# Altium schematic sheet DIOT_Connectors_Magneto.SchDoc: DIOT
size 420 x 297 mm; Project: HVPSU_ISOL.PrjPCB; Author: G.Kasprowicz; CompanyName: WUT ISE; DrawnBy: G.Kasprowicz; Organization: WUT ISE; Address1: PW ISE; Address2: Nowowiejska 15/19 00-665 Warsaw; Address3: gkasprow@gmail.com; DocumentNumber: 2; Revision: 2; SheetNumber: 2; SheetTotal: 7; ModifiedBy: -; CheckedDate: -; Title2: Connector; DivGrp: WUT ISE; Designer: G.Kasprowicz; ModifiedDate: -; ProjectName: Sensor Box
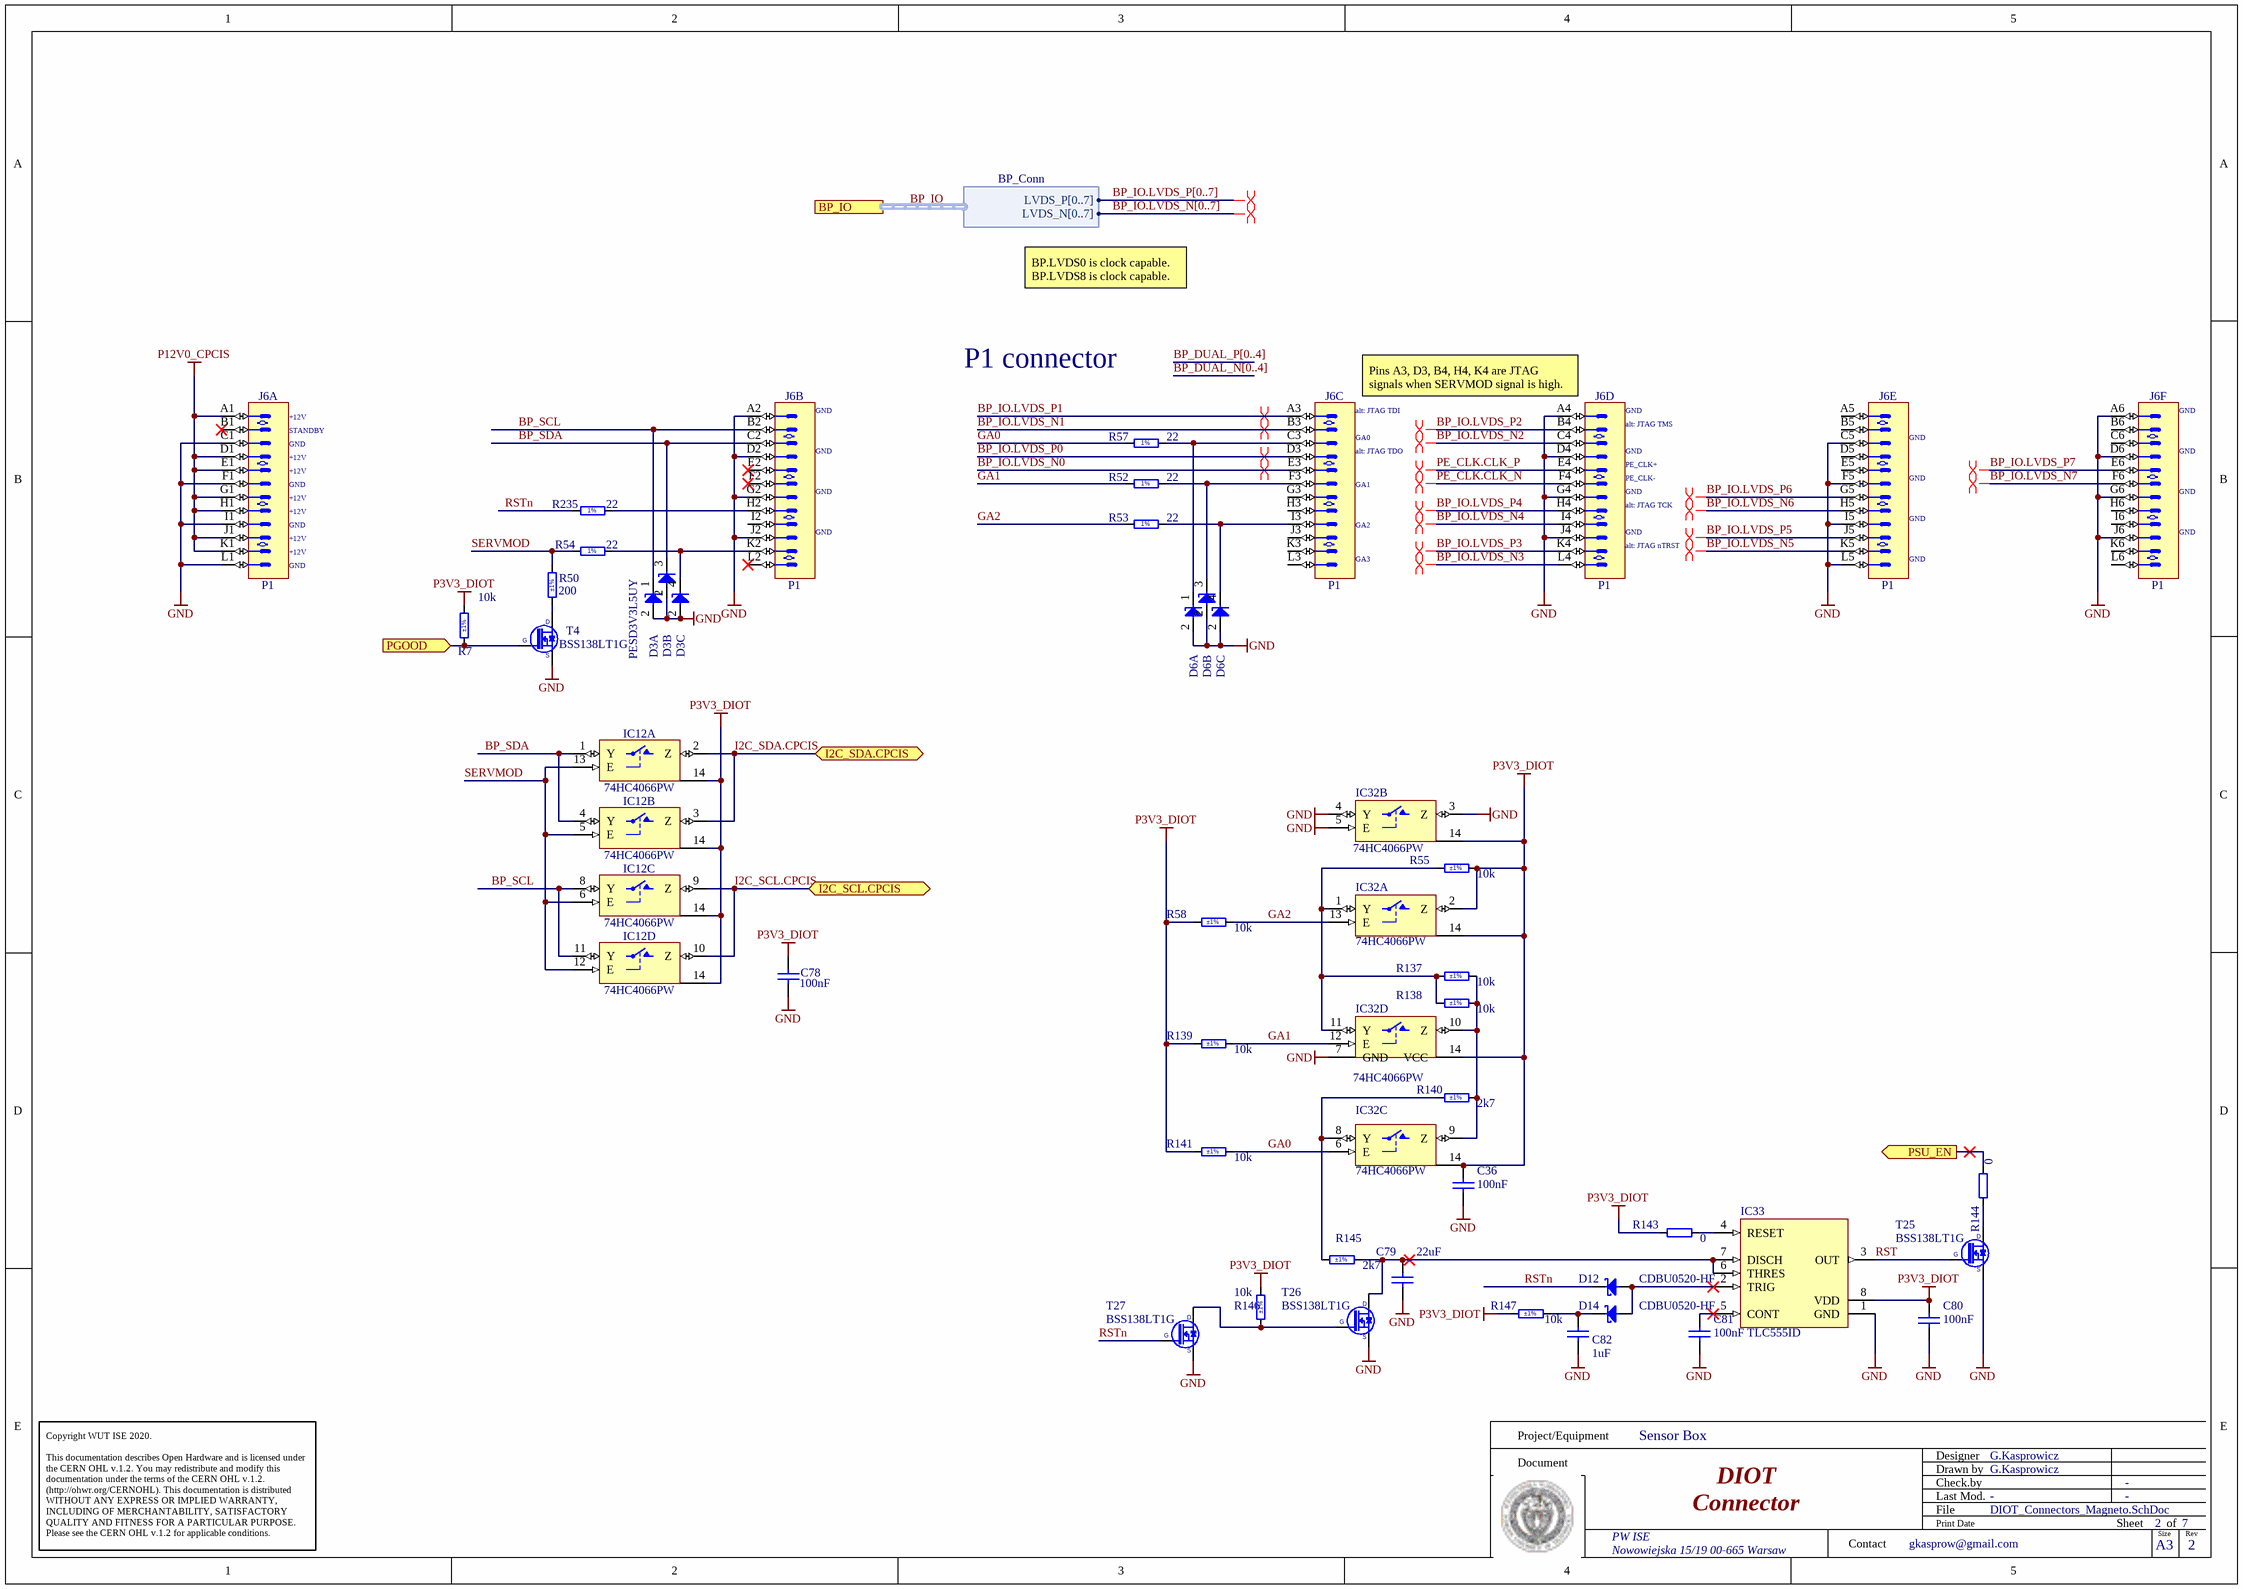
[diagram p0: DIOT_Connectors_Magneto.SchDoc]

## Parts
C36  100nF  [CAPC1608X87N]
C78  100nF  [CAPC1005X55N]
C79  22uF  [CAPC2012X135N]
C80  100nF  [CAPC1608X87N]
C81  100nF  [CAPC1608X87N]
C82  1uF  [CAPC1608X87N]
D3  PESD3V3L5UY  [SOT65P210X110-6N]  (value not drawn)  (parts A,B,C of 5)
D6  PESD3V3L5UY  [SOT65P210X110-6N]  (value not drawn)  (parts A,B,C of 5)
D12  CDBU0520-HF  [SOD-523F]
D14  CDBU0520-HF  [SOD-523F]
IC12  74HC4066PW  [SOP65P640X110-14N]  (parts A,B,C,D of 4)
IC32  74HC4066PW  [SOP65P640X110-14N]  (parts A,B,C,D of 4)
IC33  TLC555ID  [SOIC127P600X175-8N]
J6  P1  [AMPHENOL_10052825-101LF]  (parts A,B,C,D,E,F of 6)
R7  10k  Tolerance: ±1%  [RESC1608X55N]
R50  200  Tolerance: ±1%  [RESC1608X55N]
R52  22  [RESC1005X40N]
R53  22  [RESC1005X40N]
R54  22  [RESC1005X40N]
R55  10k  Tolerance: ±1%  [RESC1608X55N]
R57  22  [RESC1005X40N]
R58  10k  Tolerance: ±1%  [RESC1608X55N]
R137  10k  Tolerance: ±1%  [RESC1608X55N]
R138  10k  Tolerance: ±1%  [RESC1608X55N]
R139  10k  Tolerance: ±1%  [RESC1608X55N]
R140  2k7  Tolerance: ±1%  [RESC1608X55N]
R141  10k  Tolerance: ±1%  [RESC1608X55N]
R143  0  [RESC1608X55N]
R144  0  [RESC1608X55N]
R145  2k7  Tolerance: ±1%  [RESC1608X55N]
R146  10k  Tolerance: ±1%  [RESC1608X55N]
R147  10k  Tolerance: ±1%  [RESC1608X55N]
R235  22  [RESC1005X40N]
T4  BSS138LT1G  [SOT95P240X110-3N]
T25  BSS138LT1G  [SOT95P240X110-3N]
T26  BSS138LT1G  [SOT95P240X110-3N]
T27  BSS138LT1G  [SOT95P240X110-3N]

## Ports
BP_IO (harness BP_Conn), I2C_SCL.CPCIS (bidir), I2C_SDA.CPCIS (bidir), PGOOD (in), PSU_EN (out)

## Harnesses
BP_Conn: LVDS_P[0..7], LVDS_N[0..7]

## Nets
GND: C36.1 C78.1 C79.1 C80.1 C81.1 C82.1 D3.2(A) D6.2(A) IC12.7(GND) IC32.3(Z) IC32.4(Y) IC32.5(E) IC32.7(GND) IC33.1(GND) J6.A2 J6.A4 J6.A6 J6.C1 J6.C5 J6.D2 J6.D4 J6.D6 J6.F1 J6.F5 J6.G2 J6.G4 J6.G6 J6.I1 J6.I5 J6.J2 J6.J4 J6.J6 J6.L1 J6.L5 T4.2(S) T25.2(S) T26.2(S) T27.2(S)
P3V3_DIOT: C36.2 C78.2 C80.2 IC12.14(VCC) IC32.2(Z) IC32.14(VCC) IC33.8(VDD) R7.2 R55.2 R58.1 R139.1 R141.1 R143.1 R146.2 R147.1
P12V0_CPCIS: J6.A1 J6.D1 J6.E1 J6.G1 J6.H1 J6.J1 J6.K1
BP_IO.LVDS_N0: J6.E3
BP_IO.LVDS_N1: J6.B3
BP_IO.LVDS_N2: J6.C4
BP_IO.LVDS_N3: J6.L4
BP_IO.LVDS_N4: J6.I4
BP_IO.LVDS_N5: J6.K5
BP_IO.LVDS_N6: J6.H5
BP_IO.LVDS_N7: J6.F6
BP_IO.LVDS_P0: J6.D3
BP_IO.LVDS_P1: J6.A3
BP_IO.LVDS_P2: J6.B4
BP_IO.LVDS_P3: J6.K4
BP_IO.LVDS_P4: J6.H4
BP_IO.LVDS_P5: J6.J5
BP_IO.LVDS_P6: J6.G5
BP_IO.LVDS_P7: J6.E6
BP_SCL: D3.1(C) IC12.8(Y) IC12.11(Y) J6.B2
BP_SDA: D3.3(C) IC12.1(Y) IC12.4(Y) J6.C2
GA0: IC32.6(E) R57.1 R141.2
GA1: IC32.12(E) R52.1 R139.2
GA2: IC32.13(E) R53.1 R58.2
I2C_SCL.CPCIS: IC12.9(Z) IC12.10(Z) ; port I2C_SCL.CPCIS
I2C_SDA.CPCIS: IC12.2(Z) IC12.3(Z) ; port I2C_SDA.CPCIS
PE_CLK.CLK_N: J6.F4
PE_CLK.CLK_P: J6.E4
PGOOD: R7.1 T4.1(G) ; port PGOOD
PSU_EN: R144.2 ; port PSU_EN
RST: IC33.3(OUT) T25.1(G)
RSTn: D12.1(C) R235.1 T27.1(G)
SERVMOD: IC12.5(E) IC12.6(E) IC12.12(E) IC12.13(E) R50.2 R54.1
NetC79_2: C79.2 IC33.6(THRES) IC33.7(DISCH) R145.2 T26.3(D)
NetC81_2: C81.2 IC33.5(CONT)
NetC82_2: C82.2 D14.1(C) R147.2
NetD3_4: D3.4(C) J6.K2 R54.2
NetD6_1: D6.1(C) J6.C3 R57.2
NetD6_3: D6.3(C) J6.F3 R52.2
NetD6_4: D6.4(C) J6.I3 R53.2
NetD12_2: D12.2(A) D14.2(A) IC33.2(TRIG)
NetIC32_1: IC32.1(Y) IC32.11(Y) R55.1 R137.1 R138.1
NetIC32_8: IC32.8(Y) R140.1 R145.1
NetIC32_9: IC32.9(Z) IC32.10(Z) R137.2 R138.2 R140.2
NetIC33_4: IC33.4(RESET) R143.2
NetJ6_H2: J6.H2 R235.2
NetR50_1: R50.1 T4.3(D)
NetR144_1: R144.1 T25.3(D)
NetR146_1: R146.1 T26.1(G) T27.3(D)

Not connected (* = marked no-connect by the designer): J6 A5 B1* B5 B6 C6 D5 E2* E5 F2* G3 H3 H6 I2 I6 J3 K3 K6 L2* L3 L6

## Buses and harness runs
bus BP_DUAL_N[0..4]
bus BP_DUAL_P[0..4]
bus BP_IO.LVDS_N[0..7]
bus BP_IO.LVDS_P[0..7]
harness BP_IO = port BP_IO

## Layout directives
differential pair: (no net found under the mark), BP_IO.LVDS_N0, BP_IO.LVDS_N1, BP_IO.LVDS_N2, BP_IO.LVDS_N3, BP_IO.LVDS_N4, BP_IO.LVDS_N5, BP_IO.LVDS_N6, BP_IO.LVDS_N7, BP_IO.LVDS_P0, BP_IO.LVDS_P1, BP_IO.LVDS_P2, BP_IO.LVDS_P3, BP_IO.LVDS_P4, BP_IO.LVDS_P5, BP_IO.LVDS_P6, BP_IO.LVDS_P7, PE_CLK.CLK_N, PE_CLK.CLK_P

## Notes on the sheet
- BP.LVDS0 is clock capable.
  BP.LVDS8 is clock capable.
- P1 connector
- (near J6) Pins A3, D3, B4, H4, K4 are JTAG signals when SERVMOD signal is high.
- (near J6) +12V
- (near J6) STANDBY
- (near J6) GND
- (near J6) alt: JTAG TDI
- (near J6) alt: JTAG TDO
- (near J6) GA0
- (near J6) alt: JTAG TMS
- (near J6) GA2
- (near J6) GA1
- (near J6) alt: JTAG TCK
- (near J6) PE_CLK+
- (near J6) PE_CLK-
- (near J6) GA3
- (near J6) alt: JTAG nTRST
- Project/Equipment
- Document
- Designer
- Drawn by
- Check.by
- Copyright WUT ISE 2020.
  This documentation describes Open Hardware and is licensed under the CERN OHL v.1.2. You may redistribute and modify this documentation under the terms of the CERN OHL v.1.2. (http://ohwr.org/CERNOHL). This documentation is distributed WITHOUT ANY EXPRESS OR IMPLIED WARRANTY, INCLUDING OF MERCHANTABILITY, SATISFACTORY QUALITY AND FITNESS FOR A PARTICULAR PURPOSE. Please see the CERN OHL v.1.2 for applicable conditions.
- Contact
- File
- Last Mod.
- Print Date
- Sheet
- Size
- A3
- of
- Rev
- (in symbol R0402_22R_1%_0.0625W_100PPM) 1%

## Library data of the parts
C36 C80 C81 = CC0603_100NF_50V_10%_X7R: Non-polarised capacitor; Part Description: SMD Multilayer Chip Ceramic Capacitor; Manufacturer: GENERIC; Manufacturer1 Part Number: 223858615649; Voltage: 50V; TC: X7R; Tolerance: ±10%; Part Number: CC0603_100NF_50V_10%_X7R; Component Kind: Standard; Component Type: Standard; Pin Count: 2; Value: 100nF; Status: Preferred; Manufacturer Part Number: CC0603_100NF_50V_10%_X7R; Case: 0603; Mounted: Yes; Socket: No; SMD: Yes; Sense: No; Manufacturer1 Example: PHYCOMP; Manufacturer1 ComponentHeight: 0.87mm; HelpURL: \\cern.ch\dfs\Applications\Altium\Datasheets\CC0603_X7R_PHYCOMP.pdf; Author: CERN DEM JLC; CreateDate: 03.12.2007; LatestRevisionDate: 03.12.2007
C78 = CC0402_100NF_16V_10%_X5R: Non-polarised capacitor; Part Description: SMD Multilayer Chip Ceramic Capacitor; Manufacturer: GENERIC; Manufacturer1 Part Number: GRM155R61C104KA88D; Voltage: 16V; TC: X5R; Tolerance: ±10%; Part Number: CC0402_100NF_16V_10%_X5R; Component Kind: Standard; Component Type: Standard; Pin Count: 2; Value: 100nF; Status: None; Manufacturer Part Number: CC0402_100NF_16V_10%_X5R; Case: 0402; Mounted: Yes; Socket: No; SMD: Yes; Sense: No; Manufacturer1 Example: MURATA; Manufacturer1 ComponentHeight: 0.55mm; HelpURL: \\cern.ch\dfs\Applications\Altium\Datasheets\CC0402_X5R_MURATA_GRM.pdf; Author: CERN DEM JLC; CreateDate: 10.12.2013; LatestRevisionDate: 10.12.2013
C79 = CC0805_22UF_16V_10%_X5R: Non-polarised capacitor; Part Description: SMD Multilayer Chip Ceramic Capacitor; Manufacturer: GENERIC; Manufacturer1 Part Number: C2012X5R1C226KT; Voltage: 16V; TC: X5R; Tolerance: ±10%; Part Number: CC0805_22UF_16V_10%_X5R; Component Kind: Standard; Component Type: Standard; Pin Count: 2; Value: 22uF; Status: Preferred; Manufacturer Part Number: CC0805_22UF_16V_10%_X5R; Case: 0805; Mounted: Yes; Socket: No; SMD: Yes; Sense: No; Manufacturer1 Example: TDK; Manufacturer1 ComponentHeight: 1.35mm; HelpURL: \\cern.ch\dfs\Applications\Altium\Datasheets\CC0805_X5R_TDK_C.pdf; Author: CERN DEM JLC; CreateDate: 25.10.2012; LatestRevisionDate: 25.10.2012
C82 = CC0603_1UF_16V_10%_X7R: Non-polarised capacitor; Part Description: SMD Multilayer Chip Ceramic Capacitor; Manufacturer: GENERIC; Manufacturer1 Part Number: 223878615663; Voltage: 16V; TC: X7R; Tolerance: ±10%; Part Number: CC0603_1UF_16V_10%_X7R; Component Kind: Standard; Component Type: Standard; Pin Count: 2; Value: 1uF; Status: None; Manufacturer Part Number: CC0603_1UF_16V_10%_X7R; Case: 0603; Mounted: Yes; Socket: No; SMD: Yes; Sense: No; Manufacturer1 Example: YAGEO PHYCOMP; Manufacturer1 ComponentHeight: 0.9mm; HelpURL: \\cern.ch\dfs\Applications\Altium\Datasheets\CC0603_X7R_PHYCOMP.pdf; Author: CERN DEM JLC; CreateDate: 03.12.2007; LatestRevisionDate: 17.04.2015
D3 D6 = PESD3V3L5UY: Fivefold ESD Protection Diode Arrays; Part Description: Fivefold ESD Protection Diode Arrays (30kV); Manufacturer1: NEXPERIA; Manufacturer1 Part Number: PESD3V3L5UY,115; Voltage: 3.3V; Power: 200W; PressFit: No; Bonding: No; Part Number: PESD3V3L5UY; Component Kind: Standard; Component Type: Standard; Device: PESD3V3L5UY; PackageDescription: SOT363, SC-88, 0.65mm Pitch; 6 Pin, 1.25mm W X 2.00mm L X 1.10mm H body, IPC Medium Density; Pin Count: 6; Case: SOT363; Mounted: Yes; Socket: No; SMD: Yes; Sense: No; ComponentHeight: 1.1mm; HelpURL: \\cern.ch\dfs\Applications\Altium\Datasheets\PESD3V3L5UY.pdf; Author: CERN DEM WB; CreateDate: 05.07.2021; LatestRevisionDate: 05.07.2021
D12 D14 = CDBU0520-HF: Schottky Diode; Part Description: 20V Surface mount Schottky Barrier Diode; Manufacturer: COMCHIP; Voltage: 20V; Power: 500mA; PressFit: No; Bonding: No; Part Number: CDBU0520-HF; Component Kind: Standard; Component Type: Standard; Device: CDBU0520-HF; PackageDescription: Small Outline Diode Flat Lead (SOD-523F), Body; 1.80mm L X 1mm W X 0.85mm H; Manufacturer Part Number: CDBU0520-HF; Pin Count: 2; Case: SOD-523F; Mounted: Yes; Socket: No; SMD: Yes; Sense: No; ComponentHeight: 1mm; HelpURL: \\cern.ch\dfs\Applications\Altium\Datasheets\CDBU0520-HF.pdf; Author: CERN DEM HF; CreateDate: 13.10.2023; LatestRevisionDate: 13.10.2023
IC12 = 74HC4066PW: Part Description: Quad Single-Pole Single-Throw Analog Switch; Manufacturer1: NXP SEMICONDUCTORS; Manufacturer1 Part Number: 74HC4066PW,118; PressFit: No; Bonding: No; Part Number: 74HC4066PW; Component Kind: Standard; Component Type: Standard; Device: 74HC4066PW; PackageDescription: SOP, 14-Leads, Body 4.4x5mm (max), Pitch 0.65mm, IPC Medium Density; Pin Count: 14; Case: TSSOP14; Mounted: Yes; Socket: No; SMD: Yes; Sense: No; ComponentHeight: 1.1mm; Author: CERN DEM JLC; HelpURL: \\cern.ch\dfs\Applications\Altium\Datasheets\74HC4066PW.pdf; CreateDate: 19.11.2014; LatestRevisionDate: 19.11.2014
IC32 = 74HC4066PW: Part Description: Quad Single-Pole Single-Throw Analog Switch; Manufacturer: NXP SEMICONDUCTORS; PressFit: No; Bonding: No; Table: Standard Logic; Part Number: 74HC4066PW; Component Kind: Standard; Component Type: Standard; Device: 74HC4066PW; PackageDescription: SOP, 14-Leads, Body 4.4x5mm (max), Pitch 0.65mm, IPC Medium Density; Manufacturer Part Number: 74HC4066PW; Pin Count: 14; Case: TSSOP14; Mounted: Yes; Socket: No; SMD: Yes; ComponentHeight: 1.1mm; Author: CERN DEM JLC; HelpURL: \\cern.ch\dfs\Applications\Altium\Datasheets\74HC4066PW.pdf; CreateDate: 2014-11-19; LatestRevisionDate: 2014-11-19
IC33 = TLC555ID: LinCMOS Timer; Manufacturer: TEXAS INSTRUMENTS; PressFit: No; Bonding: No; Part Number: TLC555ID; Component Kind: Standard; Component Type: Standard; Device: TLC555ID; PackageDescription: SOIC 8, Pitch 1.27mm, Body 4x5mm, IPC Medium Density; Part Description: LinCMOS Timer; Manufacturer Part Number: TLC555ID; Pin Count: 8; Case: SOIC8; Mounted: Yes; Socket: No; SMD: Yes; Sense: No; ComponentHeight: 1.75mm; Author: CERN DEM JMW; HelpURL: \\cern.ch\dfs\Applications\Altium\Datasheets\TLC555ID.pdf; CreateDate: 23.08.2016; LatestRevisionDate: 23.08.2016
J6 = AMPHENOL_10052825-101LF: 72 Contacts Header, 6 Columns, 4 Pairs per Column; Part Description: 72 Contacts, 2mm Pitch, 6 Columns, 4 Pairs per Column, 4 Walls, Right Angle Header; Part Number: AMPHENOL_10052825-101LF; Component Kind: Standard; Component Type: Standard; Pin Count: 72; Family: AirMax VS; Mounted: Yes; Socket: No; SMD: No; PressFit: Yes; Sense: No; Status: None; Manufacturer1: AMPHENOL; Manufacturer1 Part Number: 10052825-101LF; ComponentHeight: 15.35mm; HelpURL: \\cern.ch\dfs\Applications\Altium\Datasheets\AMPHENOL_10052825-101LF.pdf; ComponentLink1URL: \\cern.ch\dfs\Applications\Altium\Datasheets\AMPHENOL_10052825-101LF_Application.pdf; ComponentLink1Description: Application; Author: CERN DEM MR; CreateDate: 19/02/2018; LatestRevisionDate: 19/02/2018; Classname: Overlapping
R7 R55 R58 R137-R139 R141 R146 R147 = R0603_10K_1%_0.1W_100PPM: Resistor - 1%; Part Description: General Purpose Thick Film Chip Resistor; Manufacturer: GENERIC; Manufacturer1 Part Number: NRC06F1002TRF; Power: 0.1W; TC: ±100ppm/°C; PressFit: No; Part Number: R0603_10K_1%_0.1W_100PPM; Component Kind: Standard; Component Type: Standard; Pin Count: 2; Value: 10k; Status: Preferred; Manufacturer Part Number: R0603_10K_1%_0.1W_100PPM; Case: 0603; Mounted: Yes; Sense: No; Socket: No; SMD: Yes; Manufacturer1 Example: NIC COMPONENT; Manufacturer1 ComponentHeight: 0.55mm; HelpURL: \\cern.ch\dfs\Applications\Altium\Datasheets\R0603_NIC_NRC.pdf; Author: CERN DEM JLC; CreateDate: 03.12.2007; LatestRevisionDate: 13.03.2008
R50 = R0603_200R_1%_0.1W_100PPM: Resistor - 1%; Part Description: General Purpose Thick Film Chip Resistor; Manufacturer: GENERIC; Manufacturer1: Vishay; Manufacturer1 Part Number: CRCW0603200RFKEA; Power: 0.1W; TC: ±100ppm/°C; PressFit: No; Part Number: R0603_200R_1%_0.1W_100PPM; Component Kind: Standard; Component Type: Standard; Pin Count: 2; Value: 200; Status: Preferred; Manufacturer Part Number: R0603_200R_1%_0.1W_100PPM; Case: 0603; Mounted: Yes; Sense: No; Socket: No; SMD: Yes; Manufacturer1 ComponentHeight: 0.55mm; HelpURL: \\cern.ch\dfs\Applications\Altium\Datasheets\R0603_NIC_NRC.pdf; Author: CERN DEM JLC; CreateDate: 03.12.2007; LatestRevisionDate: 13.03.2008
R52-R54 R57 = R0402_22R_1%_0.0625W_100PPM: Resistor - 1%; Part Description: General Purpose Thick Film Chip Resistor; Manufacturer: GENERIC; Manufacturer1: Vishay; Manufacturer1 Part Number: CRCW040222R0FKEDC; TC: ±100ppm/°C; PressFit: No; Part Number: R0402_22R_1%_0.0625W_100PPM; Component Kind: Standard; Component Type: Standard; Pin Count: 2; Value: 22; Status: Not Recommended; Power: 0.0625W; Tolerance: ±1%; Manufacturer Part Number: R0402_22R_1%_0.0625W_100PPM; Case: 0402; Mounted: Yes; Socket: No; SMD: Yes; Manufacturer1 ComponentHeight: 0.4mm; HelpURL: \\cern.ch\dfs\Applications\Altium\Datasheets\R0402_Phycomp_RC0402.pdf; Author: CERN DEM JLC; CreateDate: 03.12.2007; LatestRevisionDate: 17.10.2012; Sense: No
R140 R145 = R0603_2K7_1%_0.1W_100PPM: Resistor - 1%; Part Description: General Purpose Thick Film Chip Resistor; Manufacturer: GENERIC; Manufacturer1 Part Number: RC0603FR-072K7L; Power: 0.1W; TC: ±100ppm/°C; PressFit: No; Part Number: R0603_2K7_1%_0.1W_100PPM; Component Kind: Standard; Component Type: Standard; Pin Count: 2; Value: 2k7; Status: Preferred; Manufacturer Part Number: R0603_2K7_1%_0.1W_100PPM; Case: 0603; Mounted: Yes; Sense: No; Socket: No; SMD: Yes; Manufacturer1 Example: YAGEO PHYCOMP; Manufacturer1 ComponentHeight: 0.55mm; HelpURL: \\cern.ch\dfs\Applications\Altium\Datasheets\R0603_PHYCOMP_RC0603.pdf; Author: CERN DEM JLC; CreateDate: 02.05.2011; LatestRevisionDate: 02.05.2011
R143 R144 = R0603_0R_JUMPER: Resistor; Part Description: 1A (0.05R Max DC Resistance) Zero Ohm Jumper; Manufacturer: GENERIC; Manufacturer1 Part Number: NRC06Z0; PressFit: No; Part Number: R0603_0R_JUMPER; Component Kind: Standard; Component Type: Standard; Pin Count: 2; Value: 0; Status: Preferred; Manufacturer Part Number: R0603_0R_JUMPER; Case: 0603; Mounted: Yes; Sense: No; Socket: No; SMD: Yes; Manufacturer1 Example: NIC COMPONENT; Manufacturer1 ComponentHeight: 0.55mm; HelpURL: \\cern.ch\dfs\Applications\Altium\Datasheets\R0603_NIC_NRC.pdf; Author: CERN DEM JLC; CreateDate: 03.12.2007; LatestRevisionDate: 13.03.2008
R235 = R0402_22R_1%_0.0625W_100PPM: Resistor - 1%; Part Description: General Purpose Thick Film Chip Resistor; Manufacturer: GENERIC; Manufacturer1: Vishay; Manufacturer1 Part Number: CRCW040222R0FKEDC; PressFit: No; Part Number: R0402_22R_1%_0.0625W_100PPM; Component Kind: Standard; Component Type: Standard; Pin Count: 2; Value: 22; Status: Not Recommended; Power: 0.0625W; Tolerance: ±1%; Manufacturer Part Number: R0402_22R_1%_0.0625W_100PPM; Case: 0402; Mounted: Yes; Socket: No; SMD: Yes; Manufacturer1 ComponentHeight: 0.4mm; HelpURL: \\cern.ch\dfs\Applications\Altium\Datasheets\R0402_Phycomp_RC0402.pdf; Author: CERN DEM JLC; CreateDate: 03.12.2007; LatestRevisionDate: 17.10.2012; Sense: No
T4 T25-T27 = BSS138LT1G: N-CHANNEL MOSFET WITH DIODE; Part Description: 50V, 200mA N-Channel Enhancement Mode Field-Effect Transistor; Manufacturer: ON SEMICONDUCTOR; PressFit: No; Bonding: No; Part Number: BSS138LT1G; Component Kind: Standard; Component Type: Standard; Device: BSS138LT1G; PackageDescription: SOT23, 0.95mm Pitch; 3 Pin, 1.40mm W X 3.00mm L X 1.10mm H body, IPC Medium Density; Manufacturer Part Number: BSS138L; Pin Count: 3; Case: SOT23-3; Mounted: Yes; Socket: No; SMD: Yes; Sense: No; ComponentHeight: 1.11mm; HelpURL: \\cern.ch\dfs\Applications\Altium\Datasheets\BSS138LT1G.pdf; Author: CERN DEM JLC; CreateDate: 23.03.2009; LatestRevisionDate: 25.05.2022